# Altium schematic sheet AAS_touch_board_rev1_0.SchDoc: AAS touch board
size A4; Author: Richard Kubíček; DocumentNumber: 1; SheetNumber: 1; SheetTotal: 1; PageSize: A4; DruhPraceRadek1: Semestrální; DruhPraceRadek2: práce
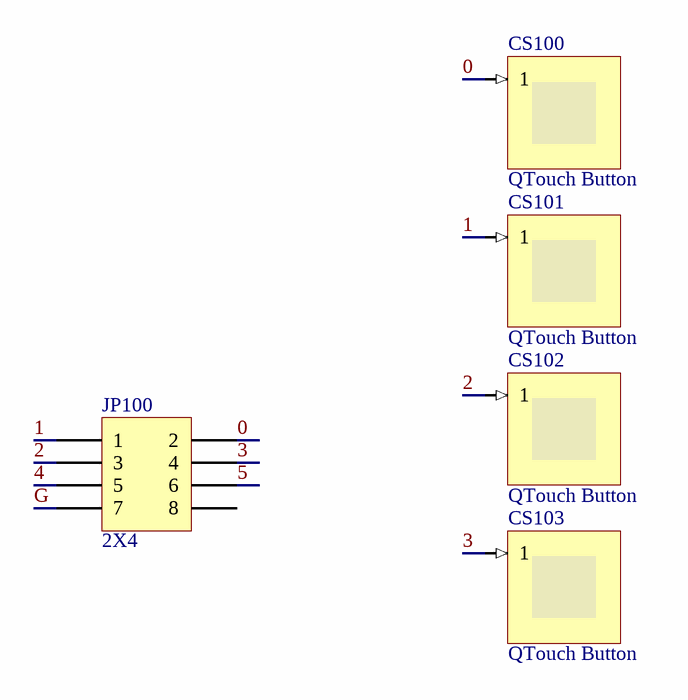
[diagram p0: AAS_touch_board_rev1_0.SchDoc]

## Parts
CS100  QTouch Button  (no BOM)
CS101  QTouch Button  (no BOM)
CS102  QTouch Button  (no BOM)
CS103  QTouch Button  (no BOM)
JP100  2X4  [HDR2X4_P2]

## Nets
0: CS100.1 JP100.2
1: CS101.1 JP100.1
2: CS102.1 JP100.3
3: CS103.1 JP100.4
4: JP100.5
5: JP100.6
G: JP100.7

Not connected (* = marked no-connect by the designer): JP100 8

## Notes on the sheet
- Druh práce
- Název dokumentu
- Projekt
- Autor
- Revize
- Strana

## Library data of the parts
CS100-CS103 = QTouchButton: ConfiguratorName: ATMEL_TOUCH; ConfigurationParameters: {}__sensorid[1]{}width[9]{}height[8]{}
JP100 = Header 2X4: Header, 8-Pin, Dual row